# Altium schematic sheet Power2.SchDoc
size Letter
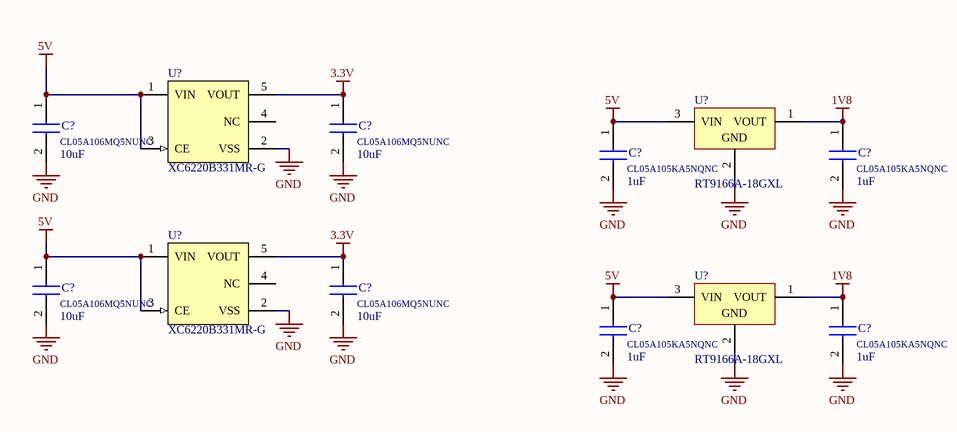
[diagram p0: Power2.SchDoc]

## Parts
(Parts that share a designator on the sheet are numbered #1, #2 ... from top to bottom, then left to right.)
C?#1  CL05A106MQ5NUNC  value 10uF  [CAPC1005X55N]
C?#2  CL05A106MQ5NUNC  value 10uF  [CAPC1005X55N]
C?#3  CL05A105KA5NQNC  value 1uF  [CAPC1005X55N]
C?#4  CL05A105KA5NQNC  value 1uF  [CAPC1005X55N]
C?#5  CL05A106MQ5NUNC  value 10uF  [CAPC1005X55N]
C?#6  CL05A106MQ5NUNC  value 10uF  [CAPC1005X55N]
C?#7  CL05A105KA5NQNC  value 1uF  [CAPC1005X55N]
C?#8  CL05A105KA5NQNC  value 1uF  [CAPC1005X55N]
U?#1  XC6220B331MR-G  [TORX-SOT-25-5_M]
U?#2  RT9166A-18GXL  [SOT-89_N]
U?#3  XC6220B331MR-G  [TORX-SOT-25-5_M]
U?#4  RT9166A-18GXL  [SOT-89_N]

## Nets
1V8: C?#4.1 C?#8.1 U?#2.1(VOUT) U?#4.1(VOUT)
3.3V: C?#2.1 C?#6.1 U?#1.5(VOUT) U?#3.5(VOUT)
5V: C?#1.1 C?#3.1 C?#5.1 C?#7.1 U?#1.1(VIN) U?#1.3(CE) U?#2.3(VIN) U?#3.1(VIN) U?#3.3(CE) U?#4.3(VIN)
GND: C?#1.2 C?#2.2 C?#3.2 C?#4.2 C?#5.2 C?#6.2 C?#7.2 C?#8.2 U?#1.2(VSS) U?#2.2(GND) U?#3.2(VSS) U?#4.2(GND)

Not connected (* = marked no-connect by the designer): U?#1 4(NC); U?#3 4(NC)

## Library data of the parts
C?#1 C?#2 C?#5 C?#6 = C0402C560K5RACTU: 10uF 0402; Manufacturer_Name: Kemet; Datasheet Link: https://content.kemet.com/datasheets/KEM_C1002_X7R_SMD.pdf; Height: 0.55mm; Manufacturer_Part_Number: C0402C560K5RACTU; Arrow Part Number: C0402C560K5RACTU; Mouser Part Number: 80-C0402C560K5RACTU; Mouser Price/Stock: https://www.mouser.co.uk/ProductDetail/KEMET/C0402C560K5RACTU?qs=gt1LBUVyoHmQZW5v3ySgNQ%3D%3D
C?#3 C?#4 C?#7 C?#8 = C0402C560K5RACTU: 1uF 0402; Manufacturer_Name: Kemet; Datasheet Link: https://content.kemet.com/datasheets/KEM_C1002_X7R_SMD.pdf; Height: 0.55mm; Manufacturer_Part_Number: C0402C560K5RACTU; Arrow Part Number: C0402C560K5RACTU; Mouser Part Number: 80-C0402C560K5RACTU; Mouser Price/Stock: https://www.mouser.co.uk/ProductDetail/KEMET/C0402C560K5RACTU?qs=gt1LBUVyoHmQZW5v3ySgNQ%3D%3D
U?#1 U?#3 = CMP-0599-00001-2: 1A LDO Voltage Regulator with CL discharge, 3.3 V, 1000 mA, -45 to 85 degC, 5-Pin SOT-25, RoHS, Reel; Manufacturer: Torex; Output Voltage: 3.3 V; Maximum Output Current: 1000 mA; ComponentLink1Description: Manufacturer URL; ComponentLink2URL: http://www.torex.co.jp/english/products/voltage_regulators/data/XC6220.pdf; DatasheetVersion: ETR0341-010a; ComponentLink1URL: http://www.torex.co.jp/; Mounting Technology: Surface Mount; Operating Ambient Temperature: -40 to 85 degC; PackageReference: SOT-25-5; PackageDescription: 5-Pin Small Out-Line Transistor, Body 2.9 x 1.65 mm, Pitch 0.95 mm; PartNumber: XC6220B331MR-G; RoHS: TRUE; Packing: Reel; ComponentLink2Description: Datasheet
U?#2 U?#4 = CMP-0244-00406-1: Positive Voltage Regulator, 5V, 4-Pin SOT-89, Tape and Reel; PackageVersion: 2011; DatasheetVersion: 1/02/2011; PackageDescription: 3-Pin SOT-89 Package 1.5 mm Pitch, 4.1 mm Lead Span; PackageReference: SOT-89; ComponentLink2Description: Datasheet; ComponentLink1URL: http://www.st.com; ComponentLink1Description: Manufacturer URL; ComponentLink2URL: http://www.st.com/internet/com/TECHNICAL_RESOURCES/TECHNICAL_LITERATURE/DATASHEET/CD00000446.pdf